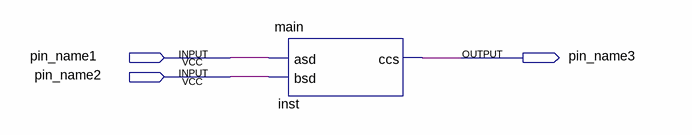
[diagram p0: schematic sheet]
// Quartus schematic logisimExample.bdf as structural Verilog: 1 symbols, 3 pins
module logisimExample (
  input  pin_name1,
  input  pin_name2,
  output pin_name3
);

  main inst (.asd(pin_name1), .bsd(pin_name2), .ccs(pin_name3));
endmodule
